# EAGLE design fuente (EAGLE 7.6.0)
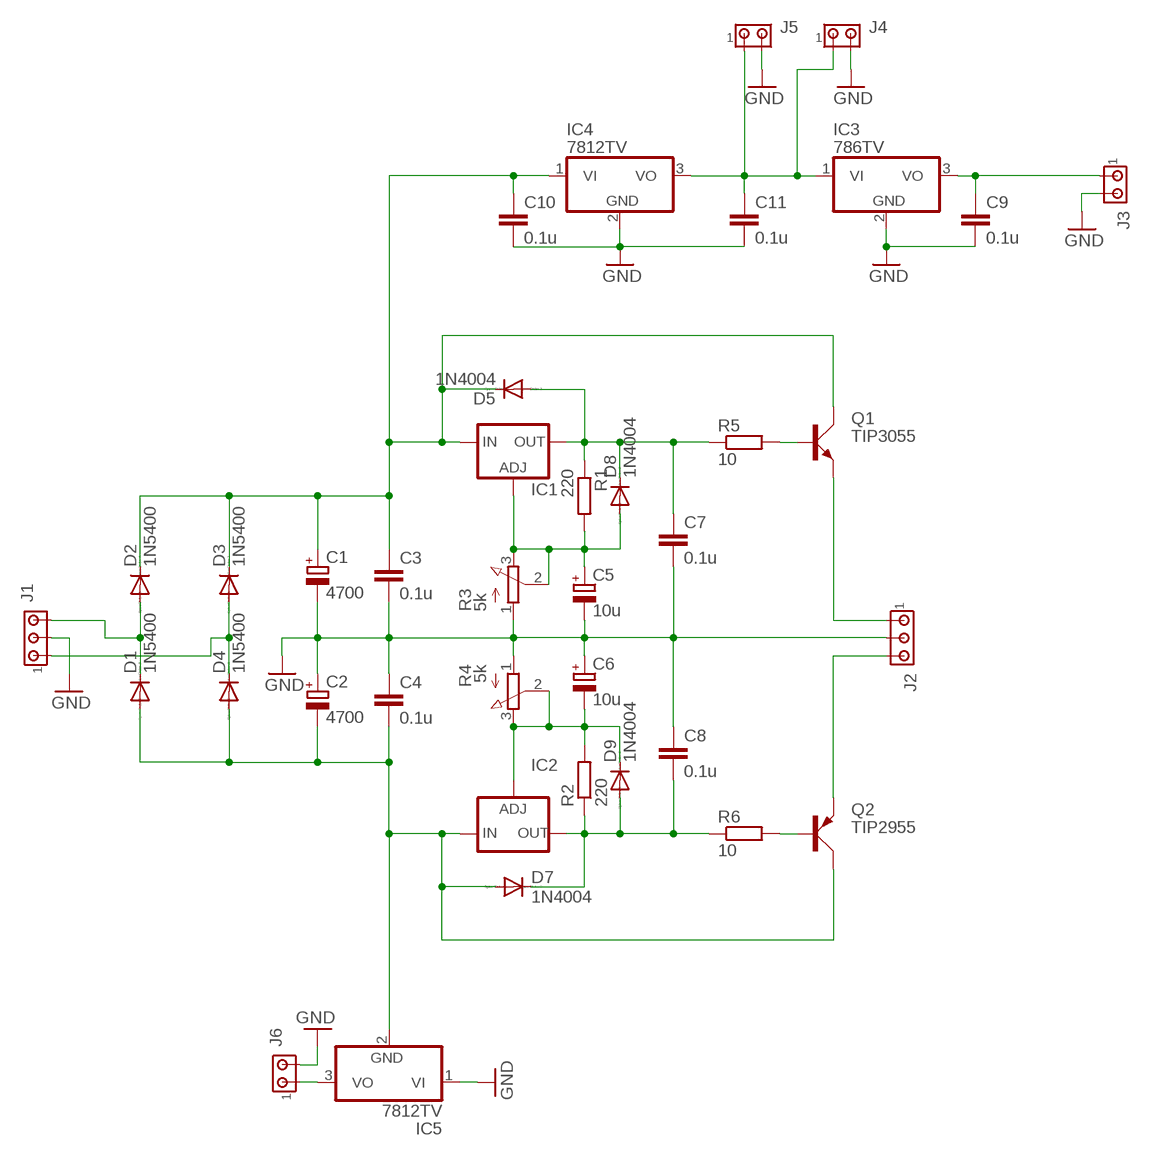
[diagram p0: schematic, sheet 1]

## Parts
C1  4700  CPOL-EUE10-22.5  [EB22,5D]
C2  4700  CPOL-EUE10-22.5  [EB22,5D]
C3  0.1u  C-EU025-024X044  [C025-024X044]
C4  0.1u  C-EU025-024X044  [C025-024X044]
C5  10u  CPOL-EUE2.5-5  [E2,5-5]
C6  10u  CPOL-EUE2.5-5  [E2,5-5]
C7  0.1u  C-EU025-024X044  [C025-024X044]
C8  0.1u  C-EU025-024X044  [C025-024X044]
C9  0.1u  C-EU025-024X044  [C025-024X044]
C10  0.1u  C-EU025-024X044  [C025-024X044]
C11  0.1u  C-EU025-024X044  [C025-024X044]
D1  1N5400  [DO201-15]
D2  1N5400  [DO201-15]
D3  1N5400  [DO201-15]
D4  1N5400  [DO201-15]
D5  1N4004  [DO41-10]
D7  1N4004  [DO41-10]
D8  1N4004  [DO41-10]
D9  1N4004  [DO41-10]
IC1  LM317TS  [317TS]
IC2  LM337TS  [337TS]
IC3  786TV  [TO220V]
IC4  7812TV  [TO220V]
IC5  7812TV  [TO220V]
J1  MTA03-156  [1X3MTA]
J2  MTA03-156  [1X3MTA]
J3  MTA02-100  [10X02MTA]
J4  MTA02-100  [10X02MTA]
J5  MTA02-100  [10X02MTA]
J6  MTA02-100  [10X02MTA]
Q1  TIP3055  [TOP3AV]
Q2  TIP2955  [TOP3AV]
R1  220  R-EU_0204/7  [0204/7]
R2  220  R-EU_0204/7  [0204/7]
R3  5k  3RP/1610N  [3RP/1610N]
R4  5k  3RP/1610N  [3RP/1610N]
R5  10  R-EU_0204/7  [0204/7]
R6  10  R-EU_0204/7  [0204/7]

## Nets
GND: C1.- C2.+ C3.2 C4.1 C5.- C6.+ C7.2 C8.1 C9.2 C10.2 C11.2 IC3.2(GND) IC4.2(GND) IC5.1(VI) J1.2 J2.2 J3.2 J4.2 J5.2 J6.2 R3.1(A) R4.1(A)
N$1: C11.1 IC3.1(VI) IC4.3(VO) J4.1 J5.1
N$2: D1.C D2.A J1.3
N$3: D3.A D4.C J1.1
N$4: C2.- C4.2 D1.A D4.A D7.A IC2.2(IN) IC5.2(GND) Q2.C
N$5: C7.1 D5.A D8.C IC1.2(OUT) R1.1 R5.1
N$6: C5.+ D8.A IC1.1(ADJ) R1.2 R3.2(S) R3.3(E)
N$7: J2.3 Q2.E
N$8: IC5.3(VO) J6.1
N$9: Q2.B R6.2
N$10: C8.2 D7.C D9.A IC2.3(OUT) R2.1 R6.1
N$11: C6.- D9.C IC2.1(ADJ) R2.2 R4.2(S) R4.3(E)
N$13: C1.+ C3.1 C10.1 D2.C D3.C D5.C IC1.3(IN) IC4.1(VI) Q1.C
N$14: Q1.B R5.2
N$15: J2.1 Q1.E
N$16: C9.1 IC3.3(VO) J3.1

## Library data of the parts
C1 C2 C5 C6 = rcl:CPOL-EU: POLARIZED CAPACITOR, European symbol
C3 C4 C7-C11 = rcl:C-EU: CAPACITOR, European symbol
D1-D4 = diode:1N5400: DIODE standard rectifier, 3 A, 50 V (Motorola)
D5 D7-D9 = diode:1N4004: DIODE general purpose rectifier, 1 A
IC1 = v-reg:LM317TS: VOLTAGE REGULATOR
IC2 = v-reg:LM337TS: VOLTAGE REGULATOR
IC3-IC5 = linear:78*: Positive VOLTAGE REGULATOR Source: http://cache.national.com/ds/LM/LM78L05.pdf http://www.fairchildsemi.com/ds/LM/LM7805.pdf
J1 J2 = con-amp:MTA03-156: AMP connector
J3-J6 = con-amp:MTA02-100: AMP connector
Q1 = transistor-power:TIP3055: NPN TRANSISTOR
Q2 = transistor-power:TIP2955: PNP TRANSISTOR
R1 R2 R5 R6 = rcl:R-EU_: RESISTOR, European symbol
R3 R4 = pot:3RP/1610N: 16mm Potentiometer one level Source: http://www.alphapotentiometers.net/html/16mm_pot_2.html

## Board
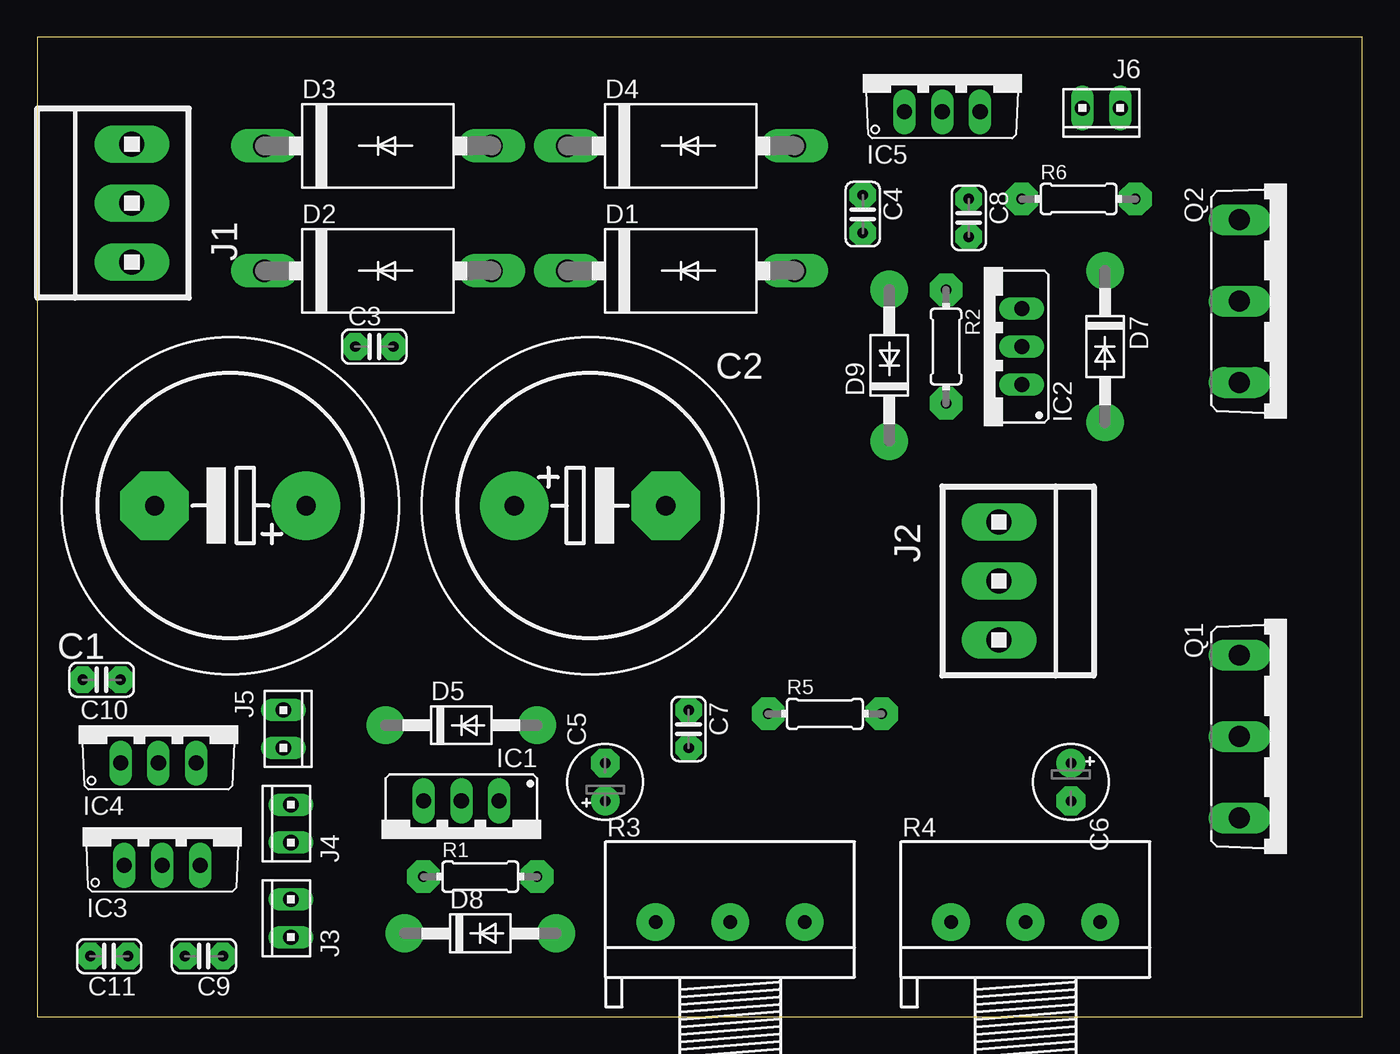
[diagram p1: board, top side]
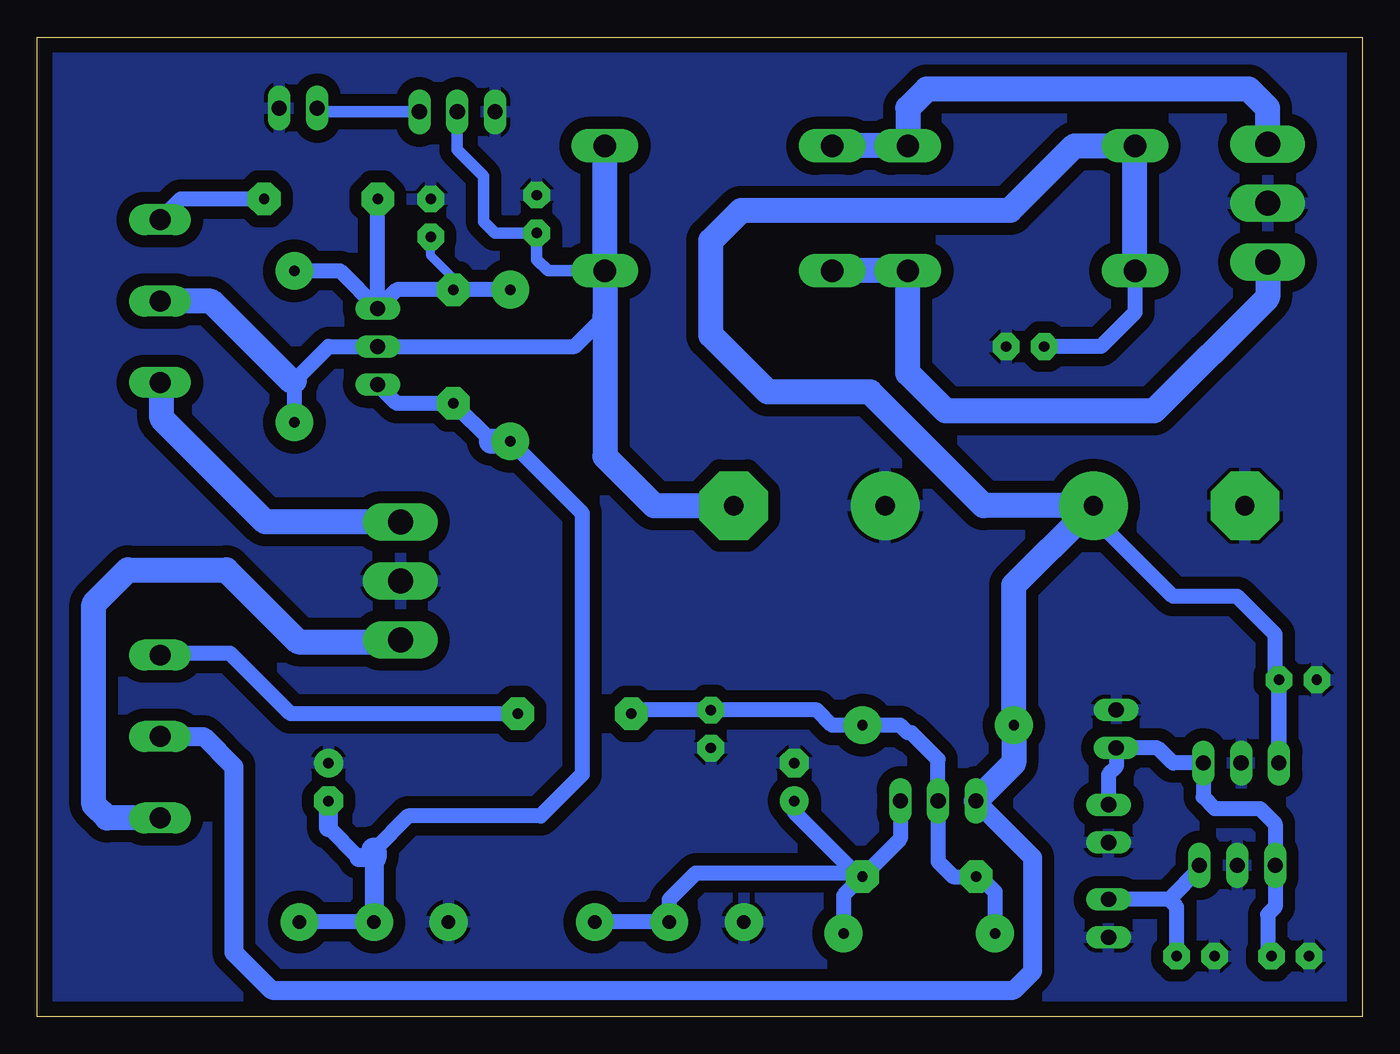
[diagram p2: board, bottom side, seen from below]

Size 88.88 x 65.71 mm. Coordinates in mm from the lower left corner, seen from the top.
Outline: 0,0 88.88,0 88.88,65.71 0,65.71 0,0
Copper layers (1*16): Top 0.035mm / dielectric 1.5mm / Bottom 0.035mm
Design rules "default": minimum track width 10mil, minimum drill 24mil, track to track 8mil, track to pad 8mil, pad to pad 8mil, via to via 8mil, smd to smd 8mil, copper to edge 40mil, drill to drill 8mil, minimum pad ring 10mil, minimum via ring 8mil, stop-mask expansion 4mil, vias tented up to drill 0mil, thermal gap 10mil

### Footprints (pad centres in the part's own frame; a part is rotated, then mirrored left to right if it is on the bottom)
EB22,5D = drill 1.3 pad 4.597: + -5.08,0 | drill 1.3 pad 4.597 octagon: - 5.08,0
C025-024X044 = drill 0.7 pad 1.778 octagon: 1 -1.27,0; 2 1.27,0
E2,5-5 = drill 0.7 pad 1.93: + -1.27,0 | drill 0.7 pad 1.93 octagon: - 1.27,0
DO201-15 = drill 1.499 long: A 7.62,0; C -7.62,0
DO41-10 = drill 0.7 pad 2.54: A 5.08,0; C -5.08,0
317TS = drill 1.016 long: 1 -2.54,-2.54; 2 0,-2.54; 3 2.54,-2.54
337TS = drill 1.016 long: 1 -2.54,-2.54; 2 0,-2.54; 3 2.54,-2.54
TO220V = drill 1.016 long: 1 -2.54,-2.54; 2 0,-2.54; 3 2.54,-2.54
1X3MTA = drill 1.676 long: 1 3.937,0; 2 -0.025,0; 3 -3.988,0
10X02MTA = drill 1.016 long: 1 1.27,0; 2 -1.27,0
TOP3AV = drill 1.397 long: B -5.461,-3.175; C 0,-3.175; E 5.461,-3.175
0204/7 = drill 0.7 pad 2.184 octagon: 1 -3.81,0; 2 3.81,0
3RP/1610N = drill 0.9 pad 2.54: 1 -5,0; 2 0,0; 3 5,0

### Placement (x,y rotation side)
C1  12.95,34.29 180 top
C2  37.08,34.29 0 top
C3  22.61,44.96 0 top
C4  55.37,53.85 270 top
C5  38.1,15.75 90 top
C6  69.34,15.75 270 top
C7  43.69,19.3 270 top
C8  62.48,53.59 270 top
C9  11.18,4.06 180 top
C10  4.32,22.61 180 top
C11  4.83,4.06 180 top
D1  43.18,50.04 0 top
D2  22.86,50.04 0 top
D3  22.86,58.42 0 top
D4  43.18,58.42 0 top
D5  28.45,19.56 0 top
D7  71.63,44.96 270 top
D8  29.72,5.59 0 top
D9  57.15,43.69 90 top
IC1  28.45,11.94 180 top
IC2  63.5,44.96 90 top
IC3  8.38,12.7 0 top
IC4  8.13,19.56 0 top
IC5  60.71,63.25 0 top
J1  6.35,54.61 90 top
J2  64.52,29.21 270 top
J3  17.02,6.6 90 top
J4  17.02,12.95 90 top
J5  16.51,19.3 270 top
J6  71.37,60.96 180 top
Q1  83.82,18.8 270 top
Q2  83.82,48.01 270 top
R1  29.72,9.4 0 top
R2  60.96,44.96 270 top
R3  46.48,6.35 0 top
R4  66.29,6.35 0 top
R5  52.83,20.32 0 top
R6  69.85,54.86 0 top

### Tracks (layer width: path | path; a pad name or v marks a point on that pad's centre or on a via)
GND
  pour Bottom (isolate 0.813): 0,66.04 88.9,66.04 88.9,0 0,0
N$1
  Bottom 1.016: J4.1 17.02,16.26 16.51,16.76 J5.1 13.72,18.03 12.7,17.02 IC4.3 10.67,14.73 9.91,13.97 6.86,13.97 5.84,12.95 IC3.1 5.84,7.37 6.35,6.86 6.35,4.32 C11.1
N$2
  Bottom 1.676: D1.C D2.A 30.48,43.18 27.94,40.64 13.97,40.64 6.35,48.26 J1.3
N$3
  Bottom 1.676: J1.1 6.35,60.96 7.62,62.23 29.21,62.23 30.48,60.96 D3.A D4.C
N$4
  Bottom 0.762: D1.A 54.61,50.04 55.37,50.8 C4.2 58.17,52.58 58.93,53.34 58.93,56.39 60.71,58.17 IC5.2
  Bottom 1.016: D7.A 71.63,42.67 69.34,44.96 IC2.2 52.83,44.96 50.8,46.99
  Bottom 1.676: D4.A D1.A 50.8,46.99 50.8,37.59 47.5,34.29 C2.- | 71.63,42.67 71.88,42.67 77.22,48.01 Q2.C
N$5
  Bottom 1.016: D8.C 24.64,8.38 25.65,9.4 R1.1 27.43,9.4 28.45,10.41 IC1.2 28.45,17.27 30.23,19.05 30.48,19.05 30.99,19.56 D5.A 35.56,19.56 36.58,20.57 C7.1 48.77,20.57 R5.1
N$6
  Bottom 1.016: IC1.1 30.99,11.94 R1.2 | R1.2 34.8,8.13 D8.A | 34.04,9.65 44.7,9.65 46.48,7.87 R3.2 R3.3 | 34.04,9.65 33.78,9.65 R1.2 | C5.+ 38.1,13.72 34.04,9.65
N$7
  Bottom 1.676: J2.3 73.58,33.2 80.52,40.13 80.52,42.42 Q2.E
N$8
  Bottom 0.61: 69.85,60.71 J6.1
  Bottom 0.762: IC5.3 69.85,60.71
N$9
  Bottom 1.016: R6.2 79.25,54.86 Q2.B
N$10
  Bottom 0.61: R2.1 60.96,49.53 62.48,51.05 C8.2
  Bottom 1.016: D7.C 68.58,50.04 IC2.3 | IC2.3 64.77,48.77 R2.1 D9.A | IC2.3 R6.1
N$11
  Bottom 1.016: IC2.1 64.77,41.15 R2.2 58.42,38.61 | 57.07,38.69 D9.C 52.83,34.29 52.32,33.78 52.32,16.26 55.12,13.46 64.01,13.46 66.29,11.18 | R4.2 R4.3 | 67.31,10.67 69.34,12.7
  Bottom 1.27: R4.2 66.29,10.67 67.31,10.67 | 69.34,12.7 C6.-
  Bottom 1.676: 58.42,38.61 D9.C | 66.29,11.18 66.29,10.67
N$13
  Bottom 1.016: C10.1 IC4.1 5.59,22.35 5.84,22.61 5.84,25.65 8.38,28.19 12.7,28.19 18.41,33.91 | D2.C 15.24,47.24 17.53,44.96 C3.1
  Bottom 1.27: Q1.C 77.72,18.8 75.69,16.76 75.69,4.32 73.15,1.78 23.37,1.78 22.1,3.05 22.1,10.67 IC1.3
  Bottom 1.676: D2.C D3.C 19.3,58.42 23.62,54.1 41.66,54.1 43.69,52.07 43.69,45.72 39.88,41.91 33.02,41.91 25.4,34.29 C1.+ 18.41,33.91 23.37,28.96 D5.C 23.37,17.02 IC1.3
N$14
  Bottom 1.016: R5.2 71.88,20.32 75.95,24.38 80.52,24.38 Q1.B
N$15
  Bottom 1.676: Q1.E 84.2,13.34 85.09,14.22 85.09,27.69 82.8,29.97 76.2,29.97 71.37,25.15 64.64,25.15 J2.1
N$16
  Bottom 1.016: IC3.3 10.92,9.91 12.95,7.87 | 12.95,7.87 J3.1 | C9.1 12.45,7.37 12.95,7.87